# Altium schematic sheet 5V_Buck.SchDoc: Title
size A3; Project: Q24 VCU; ENG_APP_DATE: --/--/--; DSN_APP_DATE: --/--/--; CHK_APP_DATE: --/--/--; Date: *******; ApprovedBy: *******; CheckedBy: None; Author: *******; CompanyName: *******; DrawnBy: Jacob Chisholm; Engineer: *******; Organization: *******; Address1: *******; Address2: *******; Address3: *******; Address4: *******; DocumentNumber: 11; Revision: *******; SheetNumber: 11; SheetTotal: 14; Address_Website: https://jchisholm204.github.io; E-Mail: JacobChisholm1010@gmail.com; CurrentTime: *******; CurrentDate: *******; Time: *******; DocumentFullPathAndName: *******; DocumentName: *******; ModifiedDate: *******; ImagePath: *******; ProjectName: *******; Application_BuildNumber: *******
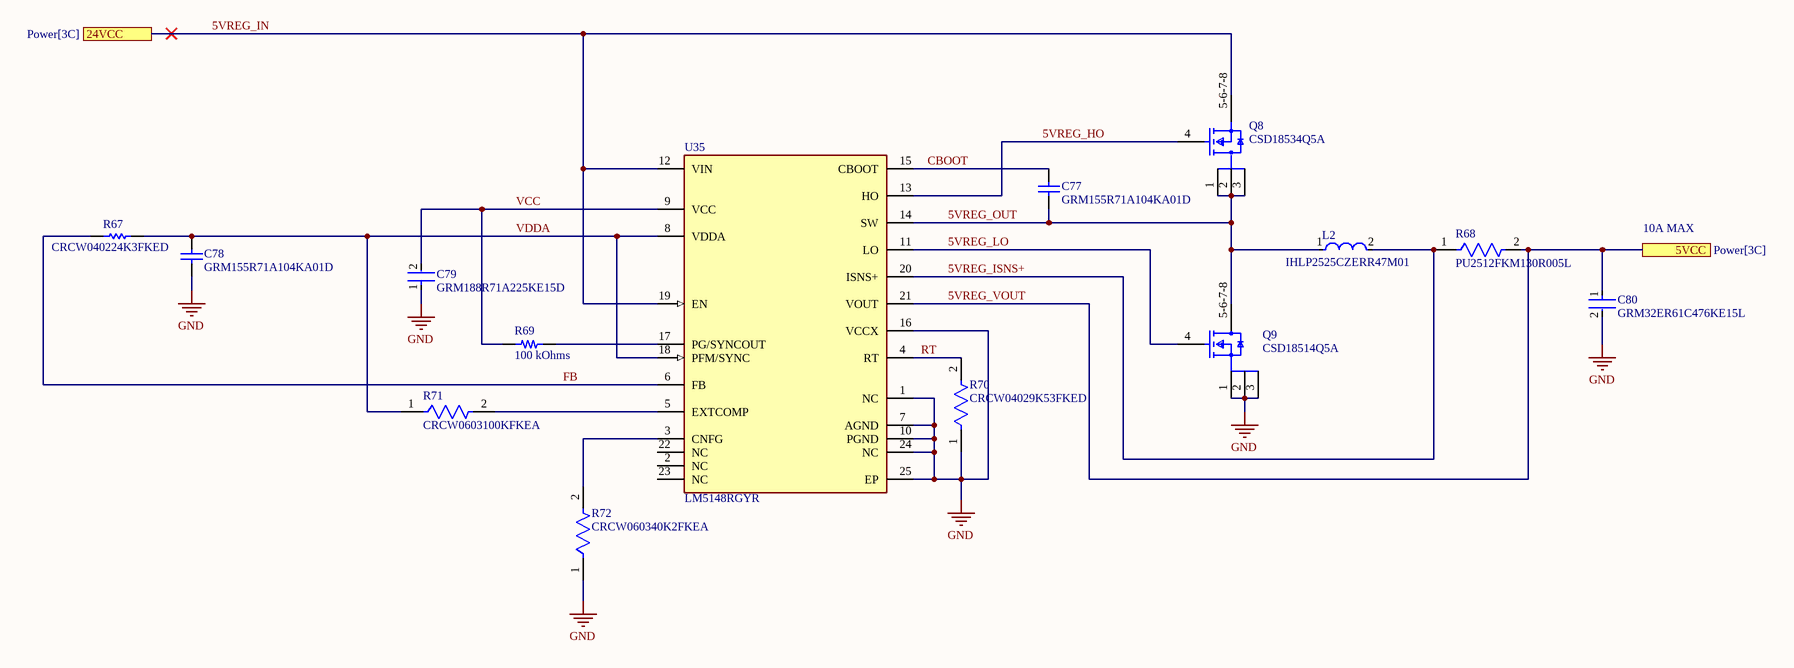
[diagram p0: 5V_Buck.SchDoc]

## Parts
C77  GRM155R71A104KA01D  [CAPC1005X55X25LL05T10]
C78  GRM155R71A104KA01D  [CAPC1005X55X25LL05T10]
C79  GRM188R71A225KE15D  [FP-GRM188-0_1-e0_2_0_5-MFG]
C80  GRM32ER61C476KE15L  [FP-GRM32E-0_3-0_2-IPC_C]
L2  IHLP2525CZERR47M01  [FP-IHLP-2525CZ-FP_2_413x3-MFG]
Q8  CSD18534Q5A  [FP-DQJ0008A-MFG]
Q9  CSD18514Q5A  [FP-DQJ0008A-MFG]
R67  CRCW040224K3FKED  [RESC1005X40X25LL05T05]
R68  PU2512FKM130R005L  [FP-PU2512-0R005-MFG]
R69  100 kOhms  [RES 0603_1608]
R70  CRCW04029K53FKED  [FP-CRCW0402-e3-MFG]
R71  CRCW0603100KFKEA  [FP-CRCW0603-e3-IPC_C]
R72  CRCW060340K2FKEA  [FP-CRCW0603-e3-IPC_B]
U35  LM5148RGYR  [FP-RGY0024F-MFG]

## Ports
5VCC (see Power[3C]), 24VCC (see Power[3C])

## Nets
GND: C78.1 C79.1 C80.2 Q9.1(S) Q9.2(S) Q9.3(S) R70.1 R72.1 U35.1(NC) U35.7(AGND) U35.10(PGND) U35.16(VCCX) U35.24(NC) U35.25(EP)
5VREG_HO: Q8.4(G) U35.13(HO)
5VREG_IN: Q8.5-6-7-8(D) U35.12(VIN) U35.19(EN) ; port 24VCC
5VREG_ISNS+: L2.2 R68.1 U35.20(ISNS+)
5VREG_LO: Q9.4(G) U35.11(LO)
5VREG_OUT: C77.1 L2.1 Q8.1(S) Q8.2(S) Q8.3(S) Q9.5-6-7-8(D) U35.14(SW)
5VREG_VOUT: C80.1 R68.2 U35.21(VOUT) ; port 5VCC
CBOOT: C77.2 U35.15(CBOOT)
FB: R67.1 U35.6(FB)
RT: R70.2 U35.4(RT)
VCC: C79.2 R69.1 U35.9(VCC)
VDDA: C78.2 R67.2 R71.1 U35.8(VDDA) U35.18(PFM/SYNC)
NetR69_2: R69.2 U35.17(PG/SYNCOUT)
NetR71_2: R71.2 U35.5(EXTCOMP)
NetR72_2: R72.2 U35.3(CNFG)

Not connected (* = marked no-connect by the designer): U35 2(NC) 22(NC) 23(NC)

## Notes on the sheet
- 10A MAX
- Title:
- Drawn By:
- Page Contents:
- Checked By:
- Size:
- Date:
- File:
- License:
- Email:
- A3
- Number:
- Time:
- Revision:
- Sheet
- Website:
- of

## Library data of the parts
C77 C78 = CMP-2000-06331-1: Chip Capacitor, 0.1 uF, +/- 10%, 10 V, -55 to 125 degC, 0402 (1005 Metric), RoHS, Tape and Reel; Manufacturer: Murata; Rated Voltage: 10V; Capacitance: 100000pF; Dielectric: X7R; Manufacturer URL: http://www.murata.com/; Datasheet Version: 02/2016; Datasheet URL: http://search.murata.co.jp/Ceramy/image/img/A01X/G101/ENG/GRM155R71A104KA01-01.pdf; Package Reference: 0402; Tolerance (%): ±10%; Package Description: 2-Pin Surface Mount Device, Body 1 x 0.5 mm; Mounting Technology: SurfaceMount; Case Size/Dimension: 0402
C79 = CMP-2006-02836-2: Chip Multilayer Ceramic Capacitors for General Purpose, 0603, 2.2uF, X7R, 15%, 10%, 10V; Case Code (Metric): 1608; Height: 0.8mm; Packaging: Cut Tape; Voltage: 10V; Lead Free: Lead Free; Min Operating Temperature: -55°C; Voltage Rating (DC): 10V; Max Operating Temperature: 125°C; Voltage Rating: 10V; Dielectric: X7R; Depth: 0.8mm; Case Code (Imperial): 0603; Termination: SMD/SMT; Case/Package: 0603; Number of Pins: 2; REACH SVHC: No SVHC; Mount: Surface Mount; Width: 0.031inch; Material: Ceramic; Capacitance: 2.2uF; Package Quantity: 1; Weight: 7.1E-05oz; Length: 1.6mm; Thickness: 0.035inch; Tolerance: 10%
C80 = CMP-2000-06362-2: CAP CER 47UF 16V X5R 1210; Tolerance: 10%; Material: Ceramic; Case Code (Metric): 3225; RoHS Compliant: Yes; Min Operating Temperature: -55°C; Radiation Hardening: No; Voltage: 16V; Package Quantity: 1; Case Code (Imperial): 1210; REACH SVHC: No SVHC; Capacitance: 47uF; Voltage Rating (DC): 16V; Dielectric: X5R; Case/Package: 1210; Length: 3.2mm; Voltage Rating: 16V; Packaging: Cut Tape; Width: 0.098inch; Number of Pins: 2; Lead Free: Lead Free; Height: 2.5mm; Mount: Surface Mount; Termination: SMD/SMT; Max Operating Temperature: 85°C; Thickness: 0.106inch; Depth: 2.5mm
L2 = CMP-2000-06445-2: Commercial Inductors, High Saturation Series 0.47uH 17.5A 4.2mΩ 20%; Saturation Current: 26A; Shielding: Shielded; Test Frequency: 100kHz; DC Resistance (DCR): 4.2mR; Self Resonant Frequency: 5MHz; Core Material: Metal; Inductance: 470nH; Case Code (Imperial): 2525; Packaging: Tape and Reel; Length: 7.24mm; Mount: Surface Mount; Contact Plating: Tin; Inductance Tolerance: 20%; Width: 6.47mm; Tolerance: 20%; Current Rating: 17.5A; Max Operating Temperature: 125°C; Min Operating Temperature: -55°C; Height - Seated (Max): 0.118inch; Case/Package: 2525; Number of Pins: 2; Depth: 6.72mm; Radiation Hardening: No; Max DC Current: 26A; Termination: SMD/SMT; Package Quantity: 2000; Lead Free: Lead Free; RMS Current (Irms): 17.5A; Height: 3mm; Military Standard: Not
Q8 = CMP-04962-000014-1: MOSFET N-CH 60V 8SON; Manufacturer: Texas Instruments; Reverse Recovery Time: 40ns; Input Capacitace At Vds: 1360pF @ 30V; Transconductance: 72S; Gate Charge At Vgs: 17nC @ 10V; Threshold Vgs Max: 2.3V; Threshold Vgs Min: 1.5V; Number Of Channels: 1; Rthja Max: 50°C/W; Continuous Drain Current: 13A; Typ Forward Diode Voltage: 0.8V; Max Forward Diode Voltage: 1V; Gate To Source Voltage: 20V; Depletion Mode: False; Turn Off Delay Time: 15ns; Drain To Source Resistance: 7.8mΩ; Max Junction Temp: +150°C; Pulse Drain Current: 229A; Power Dissipation: 3.1W; Turn On Delay Time: 5.2ns; Reverse Recovery Charge: 54nC; Digikey Description: MOSFET N-CH 60V 8SON; ComponentLink2URL: http://www.ti.com/lit/ds/symlink/csd18534q5a.pdf; Temperature Range High: +150°C; Drain To Source Voltage: 60V; Automotive: No; RoHS: TRUE; Mouser Description: MOSFET 60V N-Ch NexFET Pwr MOSFET; Temperature Range Low: -55°C; Manufacturer Part Number: CSD18534Q5A; Octopart: https://octopart.com/csd18534q5a-texas+instruments-22791040; Device Class L1: Discrete Semiconductors; Device Class L2: Transistors; ComponentLink2Description: Datasheet; Number Of N Channels: 1; Height: 1.1mm; Device Class L3: MOSFETs; Temperature: -55°C to +150°C; Lead Free: Yes; Drain To Source Breakdown Voltage: 60V; Package: DQJ0008A; Category: Trans
Q9 = CMP-04962-000077-1: MOSFET N-CH 40V 89A 8VSON; Max Power Dissipation: 74W; Rds On Max: 7.9mR; Element Configuration: Single; Number of Pins: 8; Min Operating Temperature: -55°C; Mount: Surface Mount; Packaging: Cut Tape; Drain to Source Voltage (Vdss): 40V; Max Operating Temperature: 150°C; Continuous Drain Current (ID): 89A; RoHS Compliant: Yes
R67 = CMP-2002-08406-1: Manufacturer: Vishay Dale; Part Number: CRCW040224K3FKED
R68 = CMP-03412-006804-1: METAL SHUNT RESISTOR 2512 1% 75P; Manufacturer: Yageo; Temperature Coefficient: 75ppm/°C; Resistance: 5mΩ; Automotive Grade: Grade 0; Power Rating: 4W; Value: 5mΩ; Temperature Range High: +170°C; Octopart: https://octopart.com/pu2512fkm130r005l-yageo-96774569; Series: PU; Device Class L2: Resistors; RoHS: TRUE; Device Class L1: Passive Components; Temperature Range Low: -65°C; Digikey Description: METAL SHUNT RESISTOR 2512 1% 75P; Composition: Metal Element; Automotive: Yes; Manufacturer Part Number: PU2512FKM130R005L; Lead Free: Yes; Package: PU2512-0R005; ComponentLink2URL: http://www.yageo.com/documents/recent/PYu-PU_51_RoHS_L_6.pdf; Device Class L3: Chip SMD Resistors; Height: 0.94mm; Category: Res; Temperature: -65°C to +170°C; Ipc Land Pattern Name: RESC635318X66; Tolerance: 1%; ComponentLink2Description: Datasheet
R69 = AA0603FR-07100KL: RES SMD 100K OHM 1% 1/10W 0603; Manufacturer: Yageo; Power (Watts): 0.1W, 1/10W; Temperature Coefficient: ±150ppm/°C; Part Number: AA0603FR-07100KL; Value: 100 kOhms; ComponentLink1Description: Datasheet; ComponentLink1URL: https://www.yageo.com/upload/media/product/productsearch/datasheet/rchip/PYu-AA_51_RoHS_L_3.pdf; ComponentLink2Description: DigiKey Link; ComponentLink2URL: https://www.digikey.com/en/products/detail/yageo/AA0603FR-07100KL/5888687; Composition: Thick Film; Device Package: 0603 (1608 Metric); Features: Anti-Sulfur, Automotive AEC-Q200, Moisture Resistant; Height - Seated (Max): 0.022" (0.55mm); LastUpdated: 1/24/2024 8:36:54 PM; Lifecycle Status: Active; Minimum Order: 1; Number of Terminations: 2; Operating Temperature: -55°C ~ 155°C; Package / Case: 0603 (1608 Metric); Packaging: TapeAndReel; PartId: 78895; Price: 0.01; Ratings: AEC-Q200; Resistance: 100 kOhms; Series: AA; Size / Dimension: 0.063" L x 0.031" W (1.60mm x 0.80mm); Supplier 1: DigiKey; Supplier Part Number 1: 13-AA0603FR-07100KLCT-ND; Supplier Device Package: 0603; Tolerance: ±1%
R70 = CMP-2002-00289-2: RES Thick Film, 9.53kΩ, 1%, 0.063W, 100ppm/°C, 0402; Max Power Dissipation: 63mW; Voltage Rating: 50V; Resistance: 9.53kR; Length: 1mm; Radiation Hardening: No; Width: 0.02inch; Package Quantity: 10; Temperature Coefficient: 100ppm/°C; Tolerance: 1%; Packaging: Tape and Reel; Termination: SMD/SMT; Weight: 2.3E-05oz; Number of Terminations: 2; Power Rating: 63mW; Case/Package: 0402; Case Code (Metric): 1005; Case Code (Imperial): 0402; Mount: Surface Mount; Contact Plating: Tin; Height: 0.35mm; Number of Pins: 2; Composition: Thick Film; Min Operating Temperature: -55°C; Military Standard: Not; Features: Automotive AEC-Q200; Depth: 0.5mm; Max Operating Temperature: 155°C
R71 = CMP-2000-03820-2: RES Thick Film, 100kΩ, 1%, 0.1W, 100ppm/°C, 0603; Power Rating: 100mW; Voltage Rating (DC): 75V; Resistance: 100kR; Width: 0.033inch; Temperature Coefficient: 100ppm/°C; Case/Package: 0603; Max Operating Temperature: 155°C; Packaging: Tape and Reel; Number of Pins: 2; Termination: SMD/SMT; Case Code (Metric): 1608; Composition: Thick Film; Radiation Hardening: No; Min Operating Temperature: -55°C; Voltage Rating: 75V; Lead Free: Lead Free; Number of Terminations: 2; Height: 0.45mm; Case Code (Imperial): 0603; Features: Automotive AEC-Q200; Length: 1.55mm; Max Power Dissipation: 100mW; Package Quantity: 10; Military Standard: Not; Tolerance: 1%; Depth: 0.85mm; Contact Plating: Tin; Weight: 7.1E-05oz
R72 = CMP-2000-03336-2: RES Thick Film, 40.2kΩ, 1%, 0.1W, 100ppm/°C, 0603; Voltage Rating (DC): 75V; Power Rating: 100mW; Resistance: 40.2kR; Packaging: Tape and Reel; Radiation Hardening: No; Lead Free: Lead Free; Contact Plating: Tin; Weight: 7.1E-05oz; Voltage Rating: 75V; Temperature Coefficient: 100ppm/°C; Case Code (Imperial): 0603; Max Operating Temperature: 155°C; Width: 0.85mm; Package Quantity: 5000; Termination: SMD/SMT; Case/Package: 0603; Case Code (Metric): 1608; Depth: 0.85mm; Tolerance: 1%; Composition: Thick Film; Length: 1.55mm; Military Standard: Not; Height: 0.45mm; Min Operating Temperature: -55°C
U35 = CMP-00370-134678441-1: LM5148RGYR 3.5-V to 80-V, current mode synchronous buck controller 24-VQFN -40 to 125; Manufacturer Lifecycle Status: ACTIVE; Case/Package: VQFN; Lifecycle Status: Production; Width: 3.5mm; Length: 5.5mm; NexarPartId: 134678441; Height: 1mm; Number of Pins: 24; Thickness: 900µm